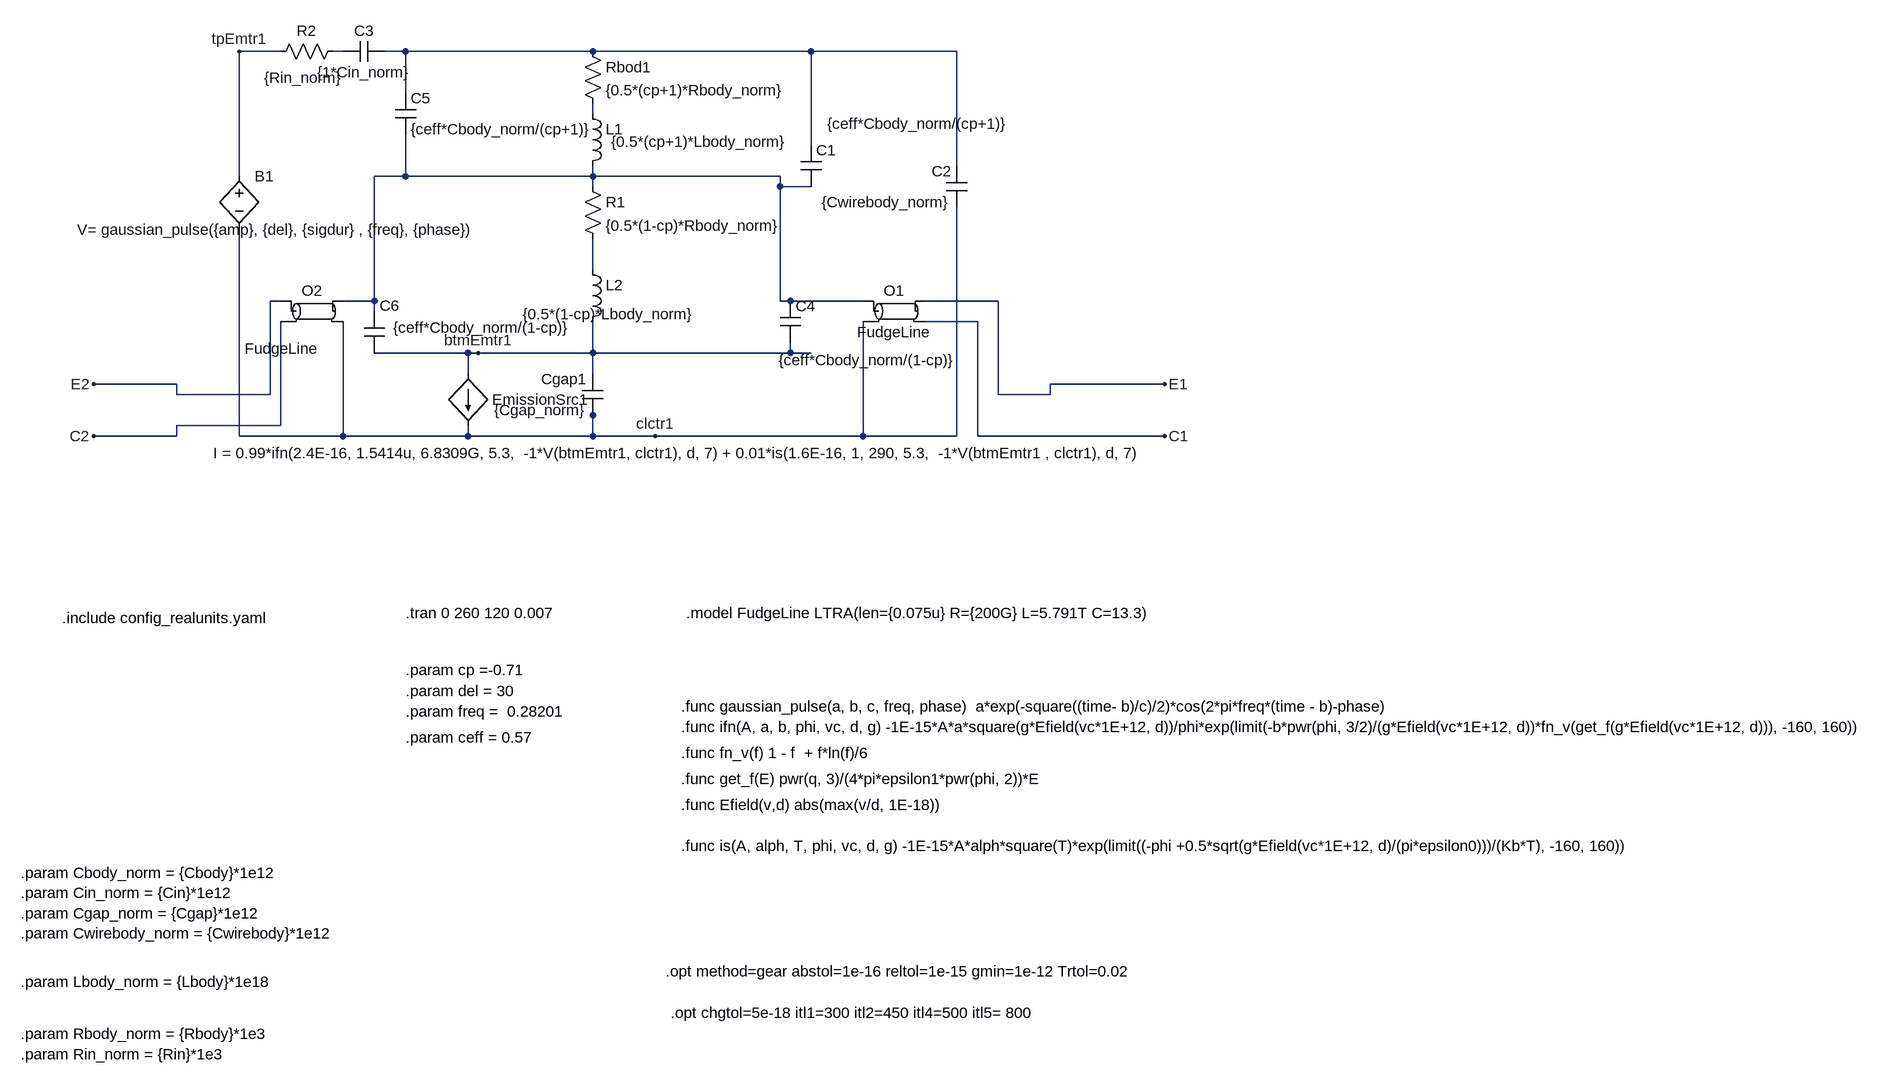
[diagram p0: schematic single_antenna_normalized.asc]
single_antenna_normalized.asc, the LTspice schematic file:
Version 4.1
SHEET 1 1804 1060
WIRE -912 -496 -976 -496
WIRE -816 -496 -832 -496
WIRE -720 -496 -752 -496
WIRE -432 -496 -720 -496
WIRE -96 -496 -432 -496
WIRE 128 -496 -96 -496
WIRE -720 -432 -720 -496
WIRE -432 -400 -432 -416
WIRE -96 -352 -96 -496
WIRE 128 -320 128 -496
WIRE -976 -304 -976 -496
WIRE -720 -304 -720 -368
WIRE -720 -304 -768 -304
WIRE -432 -304 -432 -320
WIRE -432 -304 -720 -304
WIRE -144 -304 -432 -304
WIRE -432 -288 -432 -304
WIRE -144 -288 -144 -304
WIRE -96 -288 -144 -288
WIRE -432 -160 -432 -208
WIRE -912 -112 -928 -112
WIRE -768 -112 -768 -304
WIRE -768 -112 -816 -112
WIRE -144 -112 -144 -288
WIRE -128 -112 -144 -112
WIRE -16 -112 -128 -112
WIRE 192 -112 80 -112
WIRE -768 -96 -768 -112
WIRE 160 -80 80 -80
WIRE -624 -32 -768 -32
WIRE -608 -32 -624 -32
WIRE -432 -32 -432 -80
WIRE -432 -32 -608 -32
WIRE -128 -32 -128 -48
WIRE -128 -32 -432 -32
WIRE -96 -32 -128 -32
WIRE -624 0 -624 -32
WIRE -432 0 -432 -32
WIRE -1072 16 -1200 16
WIRE 448 16 272 16
WIRE -1072 32 -1072 16
WIRE -928 32 -928 -112
WIRE -928 32 -1072 32
WIRE 192 32 192 -112
WIRE 272 32 272 16
WIRE 272 32 192 32
WIRE -432 64 -432 48
WIRE -912 80 -912 -80
WIRE -912 80 -1072 80
WIRE -1072 96 -1072 80
WIRE -1072 96 -1200 96
WIRE -976 96 -976 -224
WIRE -816 96 -816 -80
WIRE -816 96 -976 96
WIRE -624 96 -624 80
WIRE -624 96 -816 96
WIRE -432 96 -432 64
WIRE -432 96 -624 96
WIRE -336 96 -432 96
WIRE -16 96 -16 -80
WIRE -16 96 -336 96
WIRE 128 96 128 -256
WIRE 128 96 -16 96
WIRE 160 96 160 -80
WIRE 448 96 160 96
FLAG -608 -32 btmEmtr1
FLAG -336 96 clctr1
FLAG -976 -496 tpEmtr1
FLAG -1200 16 E2
FLAG -1200 96 C2
FLAG 448 16 E1
FLAG 448 96 C1
SYMBOL cap -112 -352 R0
WINDOW 3 41 -33 Left 2
SYMATTR Value {ceff*Cbody_norm/(cp+1)}
SYMATTR InstName C1
SYMBOL cap -416 64 R180
WINDOW 0 24 56 Left 2
WINDOW 3 24 8 Left 2
SYMATTR InstName Cgap1
SYMATTR Value {Cgap_norm}
SYMBOL cap 144 -256 R180
WINDOW 0 24 56 Left 2
WINDOW 3 24 8 Left 2
SYMATTR InstName C2
SYMATTR Value {Cwirebody_norm}
SYMBOL res -448 -512 R0
SYMATTR InstName Rbod1
SYMATTR Value {0.5*(cp+1)*Rbody_norm}
SYMBOL res -448 -304 R0
SYMATTR InstName R1
SYMATTR Value {0.5*(1-cp)*Rbody_norm}
SYMBOL ind -448 -416 R0
WINDOW 3 44 59 Left 2
SYMATTR Value {0.5*(cp+1)*Lbody_norm}
SYMATTR InstName L1
SYMATTR SpiceLine Rser=1m
SYMBOL ind -448 -176 R0
WINDOW 3 -92 84 Left 2
SYMATTR Value {0.5*(1-cp)*Lbody_norm}
SYMATTR InstName L2
SYMATTR SpiceLine Rser=1m
SYMBOL res -816 -512 R90
WINDOW 0 0 56 VBottom 2
WINDOW 3 41 61 VTop 2
SYMATTR InstName R2
SYMATTR Value {Rin_norm}
SYMBOL cap -752 -512 R90
WINDOW 0 0 32 VBottom 2
WINDOW 3 32 32 VTop 2
SYMATTR InstName C3
SYMATTR Value {1*Cin_norm}
SYMBOL cap -144 -112 R0
WINDOW 3 -2 91 Left 2
SYMATTR Value {ceff*Cbody_norm/(1-cp)}
SYMATTR InstName C4
SYMBOL cap -736 -432 R0
SYMATTR InstName C5
SYMATTR Value {ceff*Cbody_norm/(cp+1)}
SYMBOL cap -784 -96 R0
WINDOW 0 24 -9 Left 2
WINDOW 3 45 25 Left 2
SYMATTR InstName C6
SYMATTR Value {ceff*Cbody_norm/(1-cp)}
SYMBOL ltline 32 -96 R0
SYMATTR InstName O1
SYMATTR Value FudgeLine
SYMBOL ltline -864 -96 R0
WINDOW 3 -46 42 Top 2
SYMATTR Value FudgeLine
SYMATTR InstName O2
SYMBOL bv -976 -320 R0
WINDOW 3 -249 98 Left 2
SYMATTR Value V= gaussian_pulse({amp}, {del}, {sigdur} , {freq}, {phase})
SYMATTR InstName B1
SYMBOL bi -624 0 R0
WINDOW 3 -392 122 Left 2
WINDOW 0 37 40 Left 2
SYMATTR Value I = 0.99*ifn(2.4E-16, 1.5414u, 6.8309G, 5.3,  -1*V(btmEmtr1, clctr1), d, 7) + 0.01*is(1.6E-16, 1, 290, 5.3,  -1*V(btmEmtr1 , clctr1), d, 7)
SYMATTR InstName EmissionSrc1
TEXT -1248 376 Left 2 !.include config_realunits.yaml
TEXT -720 368 Left 2 !.tran 0 260 120 0.007
TEXT -720 456 Left 2 !.param cp =-0.71
TEXT -296 512 Left 2 !.func gaussian_pulse(a, b, c, freq, phase)  a*exp(-square((time- b)/c)/2)*cos(2*pi*freq*(time - b)-phase)
TEXT -720 488 Left 2 !.param del = 30
TEXT -720 520 Left 2 !.param freq =  0.28201
TEXT -288 368 Left 2 !.model FudgeLine LTRA(len={0.075u} R={200G} L=5.791T C=13.3)
TEXT -720 560 Left 2 !.param ceff = 0.57
TEXT -296 584 Left 2 !.func fn_v(f) 1 - f  + f*ln(f)/6
TEXT -296 624 Left 2 !.func get_f(E) pwr(q, 3)/(4*pi*epsilon1*pwr(phi, 2))*E
TEXT -296 544 Left 2 !.func ifn(A, a, b, phi, vc, d, g) -1E-15*A*a*square(g*Efield(vc*1E+12, d))/phi*exp(limit(-b*pwr(phi, 3/2)/(g*Efield(vc*1E+12, d))*fn_v(get_f(g*Efield(vc*1E+12, d))), -160, 160))
TEXT -296 664 Left 2 !.func Efield(v,d) abs(max(v/d, 1E-18))\n \n.func is(A, alph, T, phi, vc, d, g) -1E-15*A*alph*square(T)*exp(limit((-phi +0.5*sqrt(g*Efield(vc*1E+12, d)/(pi*epsilon0)))/(Kb*T), -160, 160))
TEXT -320 920 Left 2 !.opt method=gear abstol=1e-16 reltol=1e-15 gmin=1e-12 Trtol=0.02
TEXT -312 984 Left 2 !.opt chgtol=5e-18 itl1=300 itl2=450 itl4=500 itl5= 800
TEXT -1312 768 Left 2 !.param Cbody_norm = {Cbody}*1e12\n.param Cin_norm = {Cin}*1e12\n.param Cgap_norm = {Cgap}*1e12\n.param Cwirebody_norm = {Cwirebody}*1e12
TEXT -1312 936 Left 2 !.param Lbody_norm = {Lbody}*1e18
TEXT -1312 1016 Left 2 !.param Rbody_norm = {Rbody}*1e3\n.param Rin_norm = {Rin}*1e3

The netlist it stands for:
* single_antenna_normalized.asc
C1 N002 N004 {ceff*Cbody_norm/(cp+1)}
Cgap1 clctr1 btmEmtr1 {Cgap_norm}
C2 clctr1 N002 {Cwirebody_norm}
Rbod1 N002 N003 {0.5*(cp+1)*Rbody_norm}
R1 N004 N005 {0.5*(1-cp)*Rbody_norm}
L1 N003 N004 {0.5*(cp+1)*Lbody_norm} Rser=1m
L2 N005 btmEmtr1 {0.5*(1-cp)*Lbody_norm} Rser=1m
R2 N001 tpEmtr1 {Rin_norm}
C3 N002 N001 {1*Cin_norm}
C4 N004 btmEmtr1 {ceff*Cbody_norm/(1-cp)}
C5 N002 N004 {ceff*Cbody_norm/(cp+1)}
C6 N004 btmEmtr1 {ceff*Cbody_norm/(1-cp)}
O1 N004 clctr1 E1 C1 FudgeLine
O2 E2 C2 N004 clctr1 FudgeLine
B1 tpEmtr1 clctr1 V= gaussian_pulse({amp}, {del}, {sigdur} , {freq}, {phase})
B§EmissionSrc1 btmEmtr1 clctr1 I = 0.99*ifn(2.4E-16, 1.5414u, 6.8309G, 5.3,  -1*V(btmEmtr1, clctr1), d, 7) + 0.01*is(1.6E-16, 1, 290, 5.3,  -1*V(btmEmtr1 , clctr1), d, 7)
.include config_realunits.yaml
.tran 0 260 120 0.007
.param cp =-0.71
.func gaussian_pulse(a, b, c, freq, phase)  a*exp(-square((time- b)/c)/2)*cos(2*pi*freq*(time - b)-phase)
.param del = 30
.param freq =  0.28201
.model FudgeLine LTRA(len={0.075u} R={200G} L=5.791T C=13.3)
.param ceff = 0.57
.func fn_v(f) 1 - f  + f*ln(f)/6
.func get_f(E) pwr(q, 3)/(4*pi*epsilon1*pwr(phi, 2))*E
.func ifn(A, a, b, phi, vc, d, g) -1E-15*A*a*square(g*Efield(vc*1E+12, d))/phi*exp(limit(-b*pwr(phi, 3/2)/(g*Efield(vc*1E+12, d))*fn_v(get_f(g*Efield(vc*1E+12, d))), -160, 160))
.func Efield(v,d) abs(max(v/d, 1E-18))
.func is(A, alph, T, phi, vc, d, g) -1E-15*A*alph*square(T)*exp(limit((-phi +0.5*sqrt(g*Efield(vc*1E+12, d)/(pi*epsilon0)))/(Kb*T), -160, 160))
.opt method=gear abstol=1e-16 reltol=1e-15 gmin=1e-12 Trtol=0.02
.opt chgtol=5e-18 itl1=300 itl2=450 itl4=500 itl5= 800
.param Cbody_norm = {Cbody}*1e12
.param Cin_norm = {Cin}*1e12
.param Cgap_norm = {Cgap}*1e12
.param Cwirebody_norm = {Cwirebody}*1e12
.param Lbody_norm = {Lbody}*1e18
.param Rbody_norm = {Rbody}*1e3
.param Rin_norm = {Rin}*1e3
.backanno
.end